# Altium schematic sheet Sheet2.SchDoc
size A3
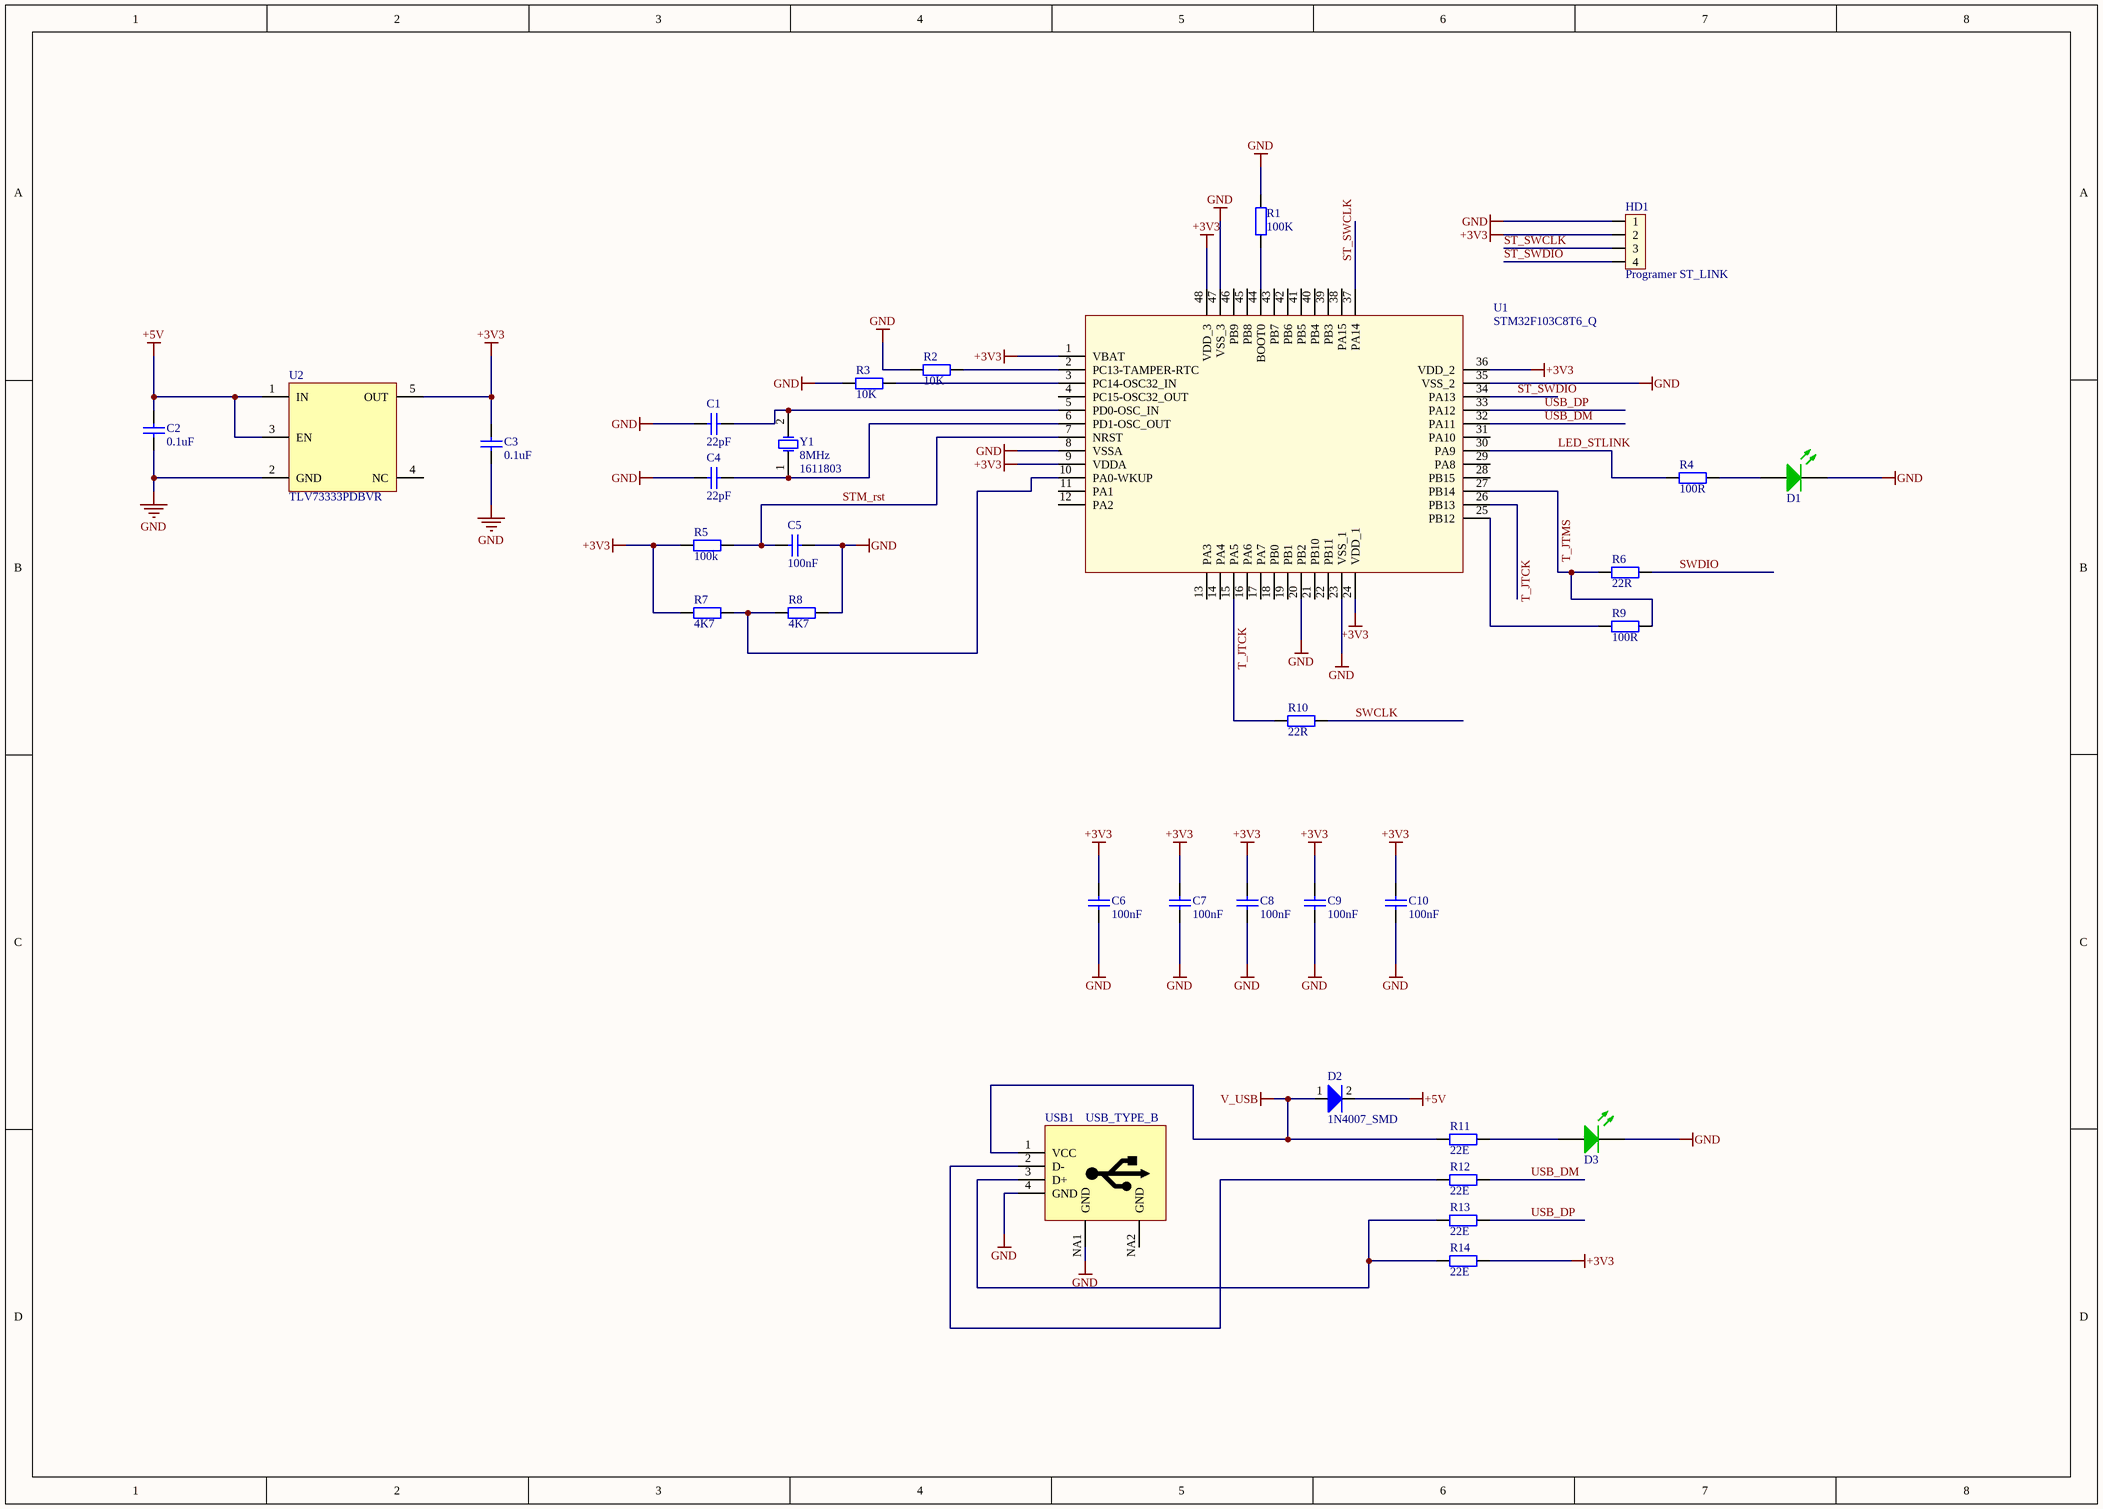
[diagram p0: Sheet2.SchDoc]

## Parts
C1  value 22pF  [Cap Ceramic 0805 SMD]  (hidden comment: Cap)
C2  value 0.1uF  [Cap Ceramic 0805 SMD]  (hidden comment: Cap)
C3  value 0.1uF  [Cap Ceramic 0805 SMD]  (hidden comment: Cap)
C4  value 22pF  [Cap Ceramic 0805 SMD]  (hidden comment: Cap)
C5  value 100nF  [Cap Ceramic 0805 SMD]  (hidden comment: Cap)
C6  value 100nF  [Cap Ceramic 0805 SMD]  (hidden comment: Cap)
C7  value 100nF  [Cap Ceramic 0805 SMD]  (hidden comment: Cap)
C8  value 100nF  [Cap Ceramic 0805 SMD]  (hidden comment: Cap)
C9  value 100nF  [Cap Ceramic 0805 SMD]  (hidden comment: Cap)
C10  value 100nF  [Cap Ceramic 0805 SMD]  (hidden comment: Cap)
D1  GREEN 0603  [LED 0603 SMD]  (value not drawn)
D2  1N4007_SMD  [1n4007 smd DO214]
D3  GREEN 0603  [LED 0603 SMD]  (value not drawn)
HD1  Programer ST_LINK  [Header_4]
R1  value 100K  [Res 0805 SMD]  (hidden comment: Res2)
R2  value 10K  [Res 0805 SMD]  (hidden comment: Res2)
R3  value 10K  [Res 0805 SMD]  (hidden comment: Res2)
R4  value 100R  [Res 0805 SMD]  (hidden comment: Res2)
R5  value 100k  [Res 0805 SMD]  (hidden comment: Res2)
R6  value 22R  [Res 0805 SMD]  (hidden comment: Res2)
R7  value 4K7  [Res 0805 SMD]  (hidden comment: Res2)
R8  value 4K7  [Res 0805 SMD]  (hidden comment: Res2)
R9  value 100R  [Res 0805 SMD]  (hidden comment: Res2)
R10  value 22R  [Res 0805 SMD]  (hidden comment: Res2)
R11  value 22E  [Res 0805 SMD]  (hidden comment: Res2)
R12  value 22E  [Res 0805 SMD]  (hidden comment: Res2)
R13  value 22E  [Res 0805 SMD]  (hidden comment: Res2)
R14  value 22E  [Res 0805 SMD]  (hidden comment: Res2)
U1  STM32F103C8T6_Q  [STM32F103C8T6_Q]
U2  TLV73333PDBVR  [TLV73333PDBVR - SOT23-65]
USB1  USB_TYPE_B  [USB_MICRO_B]
Y1  8MHz  Farnell:: 1611803  [CRYSTAL]

## Nets
+3V3: C3.2 C6.2 C7.2 C8.2 C9.2 C10.2 HD1.2 R5.1 R7.1 R14.2 U1.1(VBAT) U1.9(VDDA) U1.24(VDD_1) U1.36(VDD_2) U1.48(VDD_3) U2.5(OUT)
+5V: C2.2 D2.2(K) U2.1(IN) U2.3(EN)
GND: C1.1 C2.1 C3.1 C4.1 C5.2 C6.1 C7.1 C8.1 C9.1 C10.1 D1.2(K) D3.2(K) HD1.1 R1.2 R2.1 R3.1 R8.2 U1.8(VSSA) U1.20(PB2) U1.23(VSS_1) U1.35(VSS_2) U1.47(VSS_3) U2.2(GND) USB1.4(GND) USB1.NA1(GND)
V_USB: D2.1(A) R11.1 USB1.1(VCC)
LED_STLINK: R4.1 U1.30(PA9)
ST_SWCLK: HD1.3 U1.37(PA14)
ST_SWDIO: HD1.4 U1.34(PA13)
STM_rst: C5.1 R5.2 U1.7(NRST)
SWCLK: R10.2
SWDIO: R6.2
T_JTCK: R10.1 U1.15(PA5) U1.26(PB13)
T_JTMS: R6.1 R9.2 U1.27(PB14)
USB_DM: R12.2 U1.32(PA11)
USB_DP: R13.2 U1.33(PA12)
NetC1_2: C1.2 U1.5(PD0-OSC_IN) Y1.2(OSC2)
NetC4_2: C4.2 U1.6(PD1-OSC_OUT) Y1.1(OSC1)
NetD1_1: D1.1(A) R4.2
NetD3_1: D3.1(A) R11.2
NetR1_1: R1.1 U1.44(BOOT0)
NetR2_2: R2.2 U1.2(PC13-TAMPER-RTC)
NetR3_2: R3.2 U1.3(PC14-OSC32_IN)
NetR7_2: R7.2 R8.1 U1.10(PA0-WKUP)
NetR9_1: R9.1 U1.25(PB12)
NetR12_1: R12.1 USB1.2(D-)
NetR13_1: R13.1 R14.1 USB1.3(D+)

Not connected (* = marked no-connect by the designer): U1 4(PC15-OSC32_OUT) 11(PA1) 12(PA2) 13(PA3) 14(PA4) 16(PA6) 17(PA7) 18(PB0) 19(PB1) 21(PB10) 22(PB11) 28(PB15) 29(PA8) 31(PA10) 38(PA15) 39(PB3) 40(PB4) 41(PB5) 42(PB6) 43(PB7) 45(PB8) 46(PB9); U2 4(NC); USB1 NA2(GND)

## Library data of the parts
C1-C10 = Cap: Capacitor; Published: 8-Jun-2000; LatestRevisionDate: 17-Jul-2002; LatestRevisionNote: Re-released for DXP Platform.; PackageReference: RAD-0.3; Publisher: Altium Limited
D1 D3 = LED GREEN 0603: LED GREEN CLEAR 0603 SMD; Manufacturer: Lite-On Inc.; Manufacturer Part Number: LTST-C190KGKT; Lens Color: Colorless; Millicandela Rating: 35mcd; Lens Style/Size: Rectangle with Flat Top, 1.10mm x 0.80mm; Voltage - Forward (Vf) (Typ): 2V; Current - Test: 20mA; Viewing Angle: 130°; Wavelength - Dominant: 571nm; Wavelength - Peak: 574nm; RoHS: RoHS Compliant; Category: Optoelectronics; Packaging: Cut Tape (CT); Color: Green; Lens Transparency: Clear; Mounting Type: Surface Mount; Features: -; Package / Case: 0603 (1608 Metric); Supplier Device Package: *; Size / Dimension: 1.60mm L x 0.80mm W; Height (Max): 0.80mm; ComponentLink1URL: http://optoelectronics.liteon.com/upload/download/DS22-2000-074/S_110_LTST-C190KGKT.pdf; ComponentLink1Description: http://optoelectronics.liteon.com/upload/download/DS22-2000-074/S_110_LTST-C190KGKT.pdf; Supplier 1: Digi-Key; Supplier Part Number 1: 160-1435-1-ND
D2 = 1N4007_SMD: Diode LS 1A 1000V DO214-AC; ComponentLink1Description: Datasheet; ComponentLink1URL: D:\Dropbox\Datasheets\Diodes and Rectifiers\Diodes\1N400X.pdf; Unit Price: 0.0072
HD1 = Header4: Header 4; Value: Header 4
R1-R14 = Res2: Resistor; Published: 8-Jun-2000; LatestRevisionDate: 17-Jul-2002; LatestRevisionNote: Re-released for DXP Platform.; PackageReference: AXIAL-0.4; Publisher: Altium Limited
U2 = 20#TLV73333PDBVR: Linear Voltage Regulator IC Positive Fixed 1 Output 3.3V 300mA SOT-23-5; Digikey: 296-40673-1-ND
USB1 = USB_TYPE_B: USB TYPE B
Y1 = XTAL: Crystal Oscillator; Published: 8-Jun-2000; LatestRevisionDate: 17-Jul-2002; LatestRevisionNote: Re-released for DXP Platform.; PackageReference: R38; Publisher: Altium Limited